# EAGLE schematic Touch.Cat.0.6 (EAGLE 9.6.2)
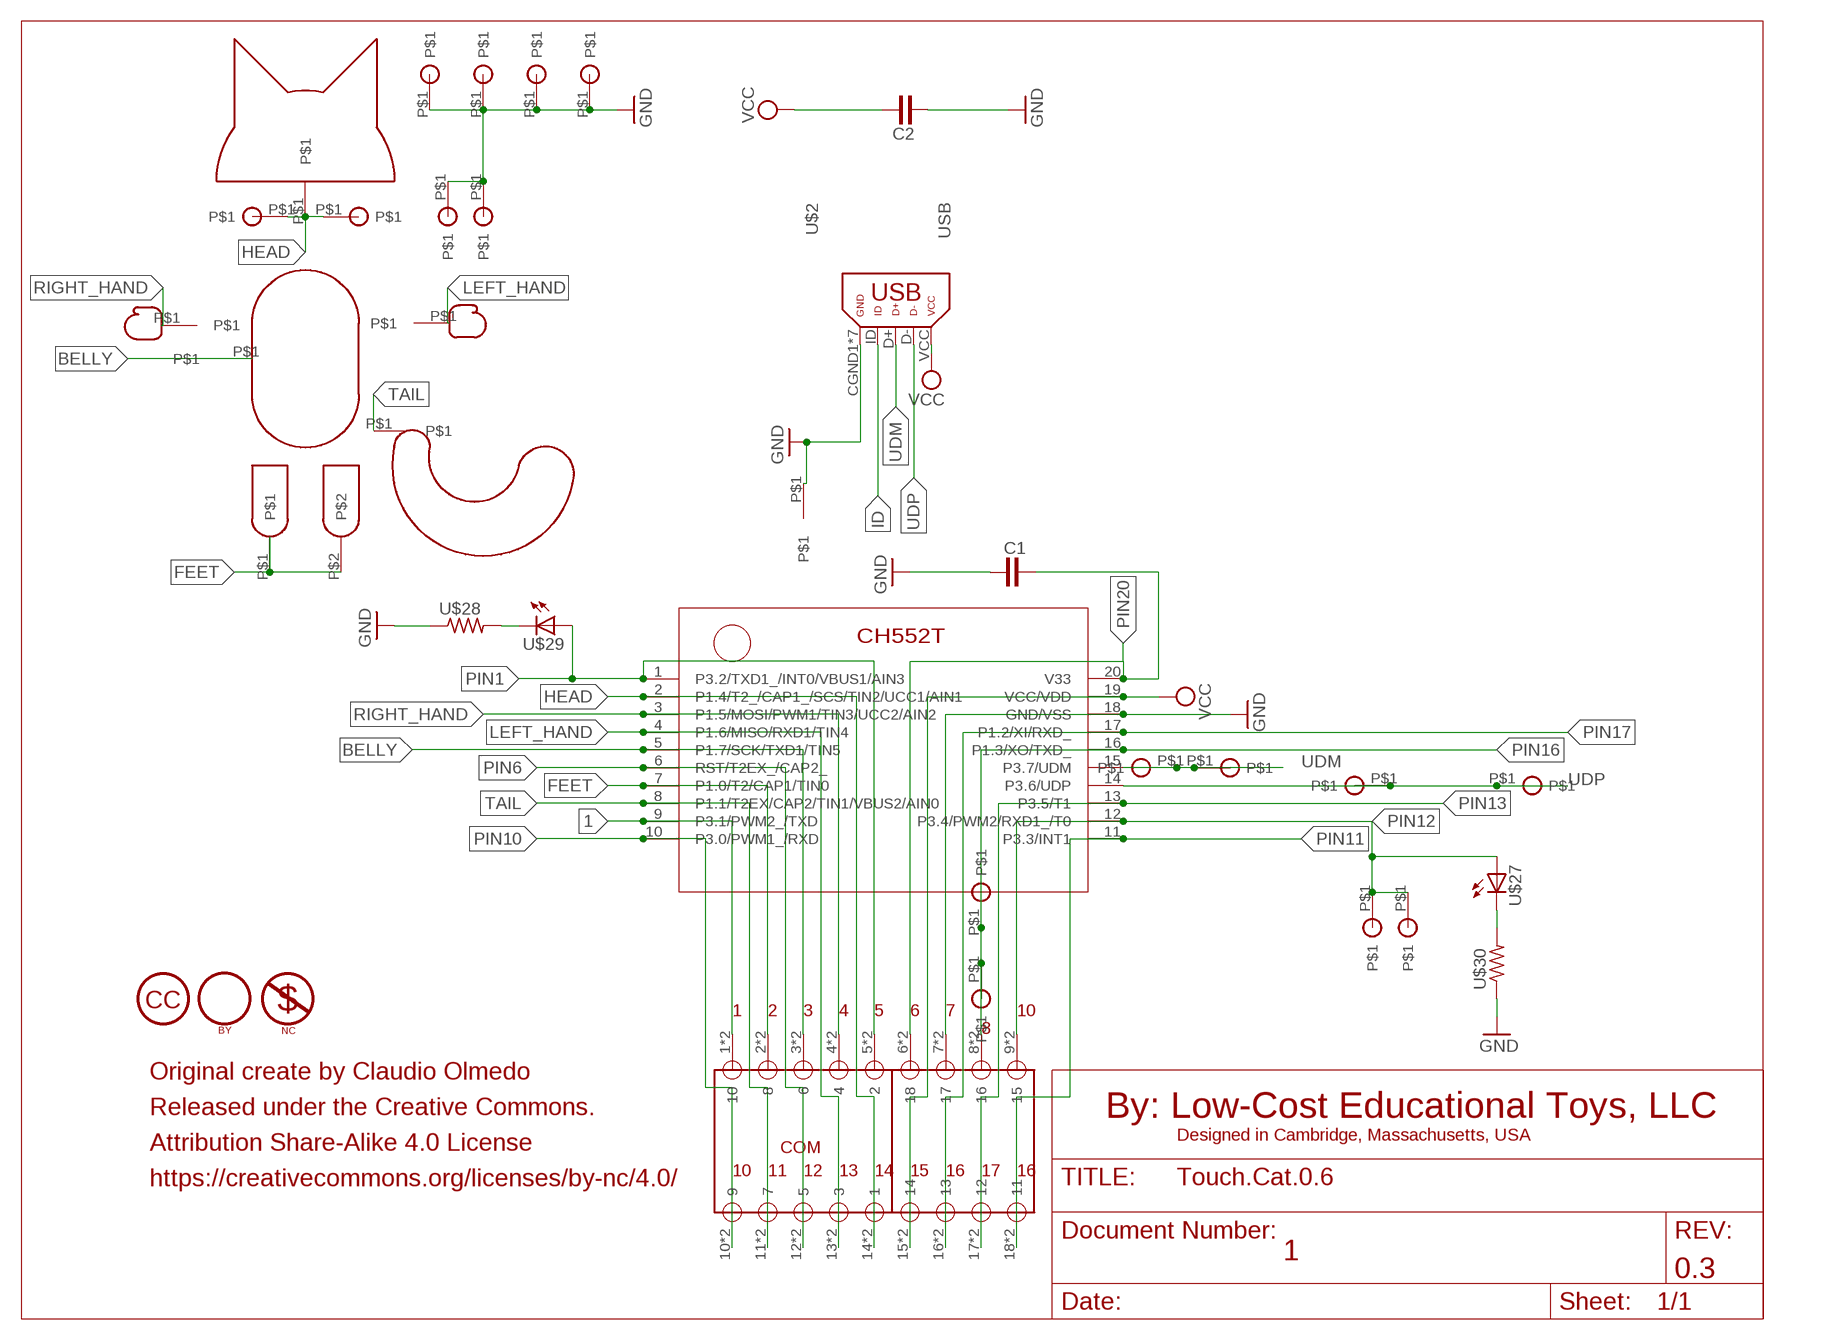
[diagram p0: schematic, sheet 1]

## Parts
C1  CAPACITOR  [C0402]
C2  CAPACITOR  [C0402]
U$1  CHIP-TOUCH-CAT  [TSSOP20]
U$2  USB  [GHI-CONNECTORS_10118192-0001LF(MICRO-USB-B-AMPHENOL-FCI)]
U$3  PADVIA  [PADVIA]
U$4  COM-TOUCH-CAT  [COM]
U$5  PADVIA  [PADVIA]
U$6  PADVIA  [PADVIA]
U$7  PADVIA  [PADVIA]
U$8  PADVIA  [PADVIA]
U$9  PADVIA  [PADVIA]
U$11  PADVIA  [PADVIA]
U$12  PADVIA  [PADVIA]
U$13  PADVIA  [PADVIA]
U$14  PADVIA  [PADVIA]
U$15  PADVIA  [PADVIA]
U$16  PADVIA  [PADVIA]
U$17  HEAD-TOUCH-CAT  [HEAD-TOUCH-CAT]
U$18  BELLY-TOUCH-CAT  [BELLY-TOUCH-CAT]
U$19  RIGHT_HAND-TOUCH-CAT  [RIGHT_HAND-TOUCH-CAT]
U$20  LEFT_HAND-TOUCH-CAT  [LEFT_HAND-TOUCH-CAT]
U$21  FEET-TOUCH-CAT  [FEET-TOUCH-CAT]
U$22  TAIL-TOUCH-CAT  [TAIL-TOUCH-CAT]
U$23  PADVIA  [PADVIA]
U$24  PADVIA  [PADVIA]
U$25  PADVIA  [PADVIA]
U$26  PADVIA  [PADVIA]
U$27  LED-TOUCH-CAT  [0603-ORANGE]
U$28  RESISTOR-TOUCH-CAT  [R0402]
U$29  LED-TOUCH-CAT  [0603-ORANGE]
U$30  RESISTOR-TOUCH-CAT  [R0402]
U$31  OSHW-LOGO  [OSHW-LOGO-MINI]
U$33  ABOUT-TOUCH-CAT  [ABOUT-TOUCH-CAT]

## Nets
1: U$1.9(P3.1/PWM2_/TXD) U$4.1 U$4.1.1
BELLY: U$1.5(P1.7/SCK/TXD1/TIN5) U$4.3 U$4.3.1 U$18.P$1
FEET: U$1.7(P1.0/T2/CAP1/TIN0) U$4.2 U$4.2.1 U$21.P$1 U$21.P$2
GND: C1.1 C2.1 U$1.18(GND/VSS) U$2.CGND1(GND) U$2.CGND2(GND) U$2.CGND3(GND) U$2.CGND4(GND) U$2.CGND5(GND) U$2.CGND6(GND) U$2.GND U$4.7 U$4.7.1 U$6.P$1 U$7.P$1 U$23.P$1 U$24.P$1 U$25.P$1 U$26.P$1 U$28.1 U$30.1 U$31.P$1
HEAD: U$1.2(P1.4/T2_/CAP1_/SCS/TIN2/UCC1/AIN1) U$4.14 U$4.14.1 U$8.P$1 U$9.P$1 U$17.P$1
ID: U$2.ID
LEFT_HAND: U$1.4(P1.6/MISO/RXD1/TIN4) U$4.13 U$4.13.1 U$20.P$1
N$2: U$27.C U$30.2
N$19: U$28.2 U$29.C
PIN1: U$1.1(P3.2/TXD1_/INT0/VBUS1/AIN3) U$4.5 U$4.5.1 U$29.A
PIN6: U$1.6(RST/T2EX_/CAP2_) U$4.12 U$4.12.1
PIN10: U$1.10(P3.0/PWM1_/RXD) U$4.10 U$4.10.1
PIN11: U$1.11(P3.3/INT1) U$4.18 U$4.18.1
PIN12: U$1.12(P3.4/PWM2/RXD1_/T0) U$3.P$1 U$4.9 U$4.9.1 U$5.P$1 U$27.A
PIN13: U$1.13(P3.5/T1) U$4.17 U$4.17.1
PIN16: U$1.16(P1.3/XO/TXD_) U$4.8 U$4.8.1 U$11.P$1 U$12.P$1
PIN17: U$1.17(P1.2/XI/RXD_) U$4.16 U$4.16.1
PIN20: C1.2 U$1.20(V33) U$4.6 U$4.6.1
RIGHT_HAND: U$1.3(P1.5/MOSI/PWM1/TIN3/UCC2/AIN2) U$4.4 U$4.4.1 U$19.P$1
TAIL: U$1.8(P1.1/T2EX/CAP2/TIN1/VBUS2/AIN0) U$4.11 U$4.11.1 U$22.P$1
UDM: U$1.15(P3.7/UDM) U$2.D+ U$13.P$1 U$14.P$1
UDP: U$1.14(P3.6/UDP) U$2.D- U$15.P$1 U$16.P$1
VCC: C2.2 U$1.19(VCC/VDD) U$2.VCC U$4.15 U$4.15.1

## Notes on the sheet
- CC | $
- 1 | 2 | 3 | 4 | 5 | 6 | 7 | 10
- NC | 8
- Original create by Claudio Olmedo
- Released under the Creative Commons. | By: Low-Cost Educational Toys, LLC
- Designed in Cambridge, Massachusetts, USA
- Attribution Share-Alike 4.0 License
- 10 | 11 | 12 | 13 | 14 | 15 | 16 | 17 | 16
- https://creativecommons.org/licenses/by-nc/4.0/
- 1
- 0.3

## Library data of the parts
C1 C2 = Touch:CAPACITOR
U$1 = Touch-cat:CHIP-TOUCH-CAT: Copyrights: www.chip-brain.com If modified stay original creator www.chip-brain.com
U$2 = chip-brain:USB: chip-brain.com Copyrights: chip-brain.com If modified stay original creator chip-brain.com
U$3 U$5-U$9 U$11-U$16 U$23-U$26 = Touch-cat:PADVIA: PAD VIA - Touch Cat Copyrights: www.touch.cat If modified stay original creator www.touch.cat
U$4 = Touch-cat:COM-TOUCH-CAT: COM - Touch Cat Copyrights: www.touch.cat If modified stay original creator www.touch.cat
U$17 = Touch-cat:HEAD-TOUCH-CAT: Head - Touch Cat Copyrights: www.touch.cat If modified stay original creator www.touch.cat
U$18 = Touch-cat:BELLY-TOUCH-CAT: Belly - Touch Cat Copyrights: www.touch.cat If modified stay original creator www.touch.cat
U$19 = Touch-cat:RIGHT_HAND-TOUCH-CAT: Right Hand - Touch Cat Copyrights: www.touch.cat If modified stay original creator www.touch.cat
U$20 = Touch-cat:LEFT_HAND-TOUCH-CAT: Left Hand - Touch Cat Copyrights: www.touch.cat If modified stay original creator www.touch.cat
U$21 = Touch-cat:FEET-TOUCH-CAT: Feet - Touch Cat Copyrights: www.touch.cat If modified stay original creator www.touch.cat
U$22 = Touch-cat:TAIL-TOUCH-CAT: TAIL - Touch Cat Copyrights: www.touch.cat If modified stay original creator www.touch.cat
U$27 U$29 = Touch-cat:LED-TOUCH-CAT: Led - Touch Cat Copyrights: www.touch.cat If modified stay original creator www.touch.cat
U$28 U$30 = Touch-cat:RESISTOR-TOUCH-CAT: Resistor - Touch Cat Copyrights: www.touch.cat If modified stay original creator www.touch.cat
U$31 = chip-brain:OSHW-LOGO
U$33 = Touch-cat:ABOUT-TOUCH-CAT: About - Touch Cat Copyrights: www.touch.cat If modified stay original creator www.touch.cat